# Altium schematic sheet USBPort-Slave.SchDoc
size A3
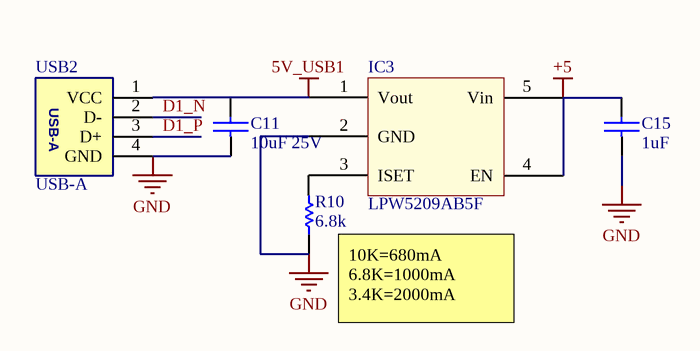
[diagram p0: USBPort-Slave.SchDoc]

## Parts
C11  10uF 25V  [0805C]
C15  1uF  [0402C]
IC3  LPW5209AB5F  [SOT23-5]
R10  6.8k  [0402R]
USB2  USB-A  [USB-A/S_F]

## Nets
5V_USB1: C11.2 IC3.1(Vout) USB2.1(VCC)
+5: C15.2 IC3.4(EN) IC3.5(Vin)
GND: C11.1 C15.1 IC3.2(GND) R10.1 USB2.4(GND)
D1_N: USB2.2(D-)
D1_P: USB2.3(D+)
NetIC3_3: IC3.3(ISET) R10.2

## Notes on the sheet
- (near R10) 10K=680mA
  6.8K=1000mA
  3.4K=2000mA

## Library data of the parts
C11 = CAP: 无极性电容; Supplier Part Number: C59782
C15 = CAP-NP
IC3 = LPW5209AB5F: USB 限流开关
R10 = RES
USB2 = USB-A: Supplier Part Number: C39416